# EAGLE design estop_latch_board (EAGLE 5.06)
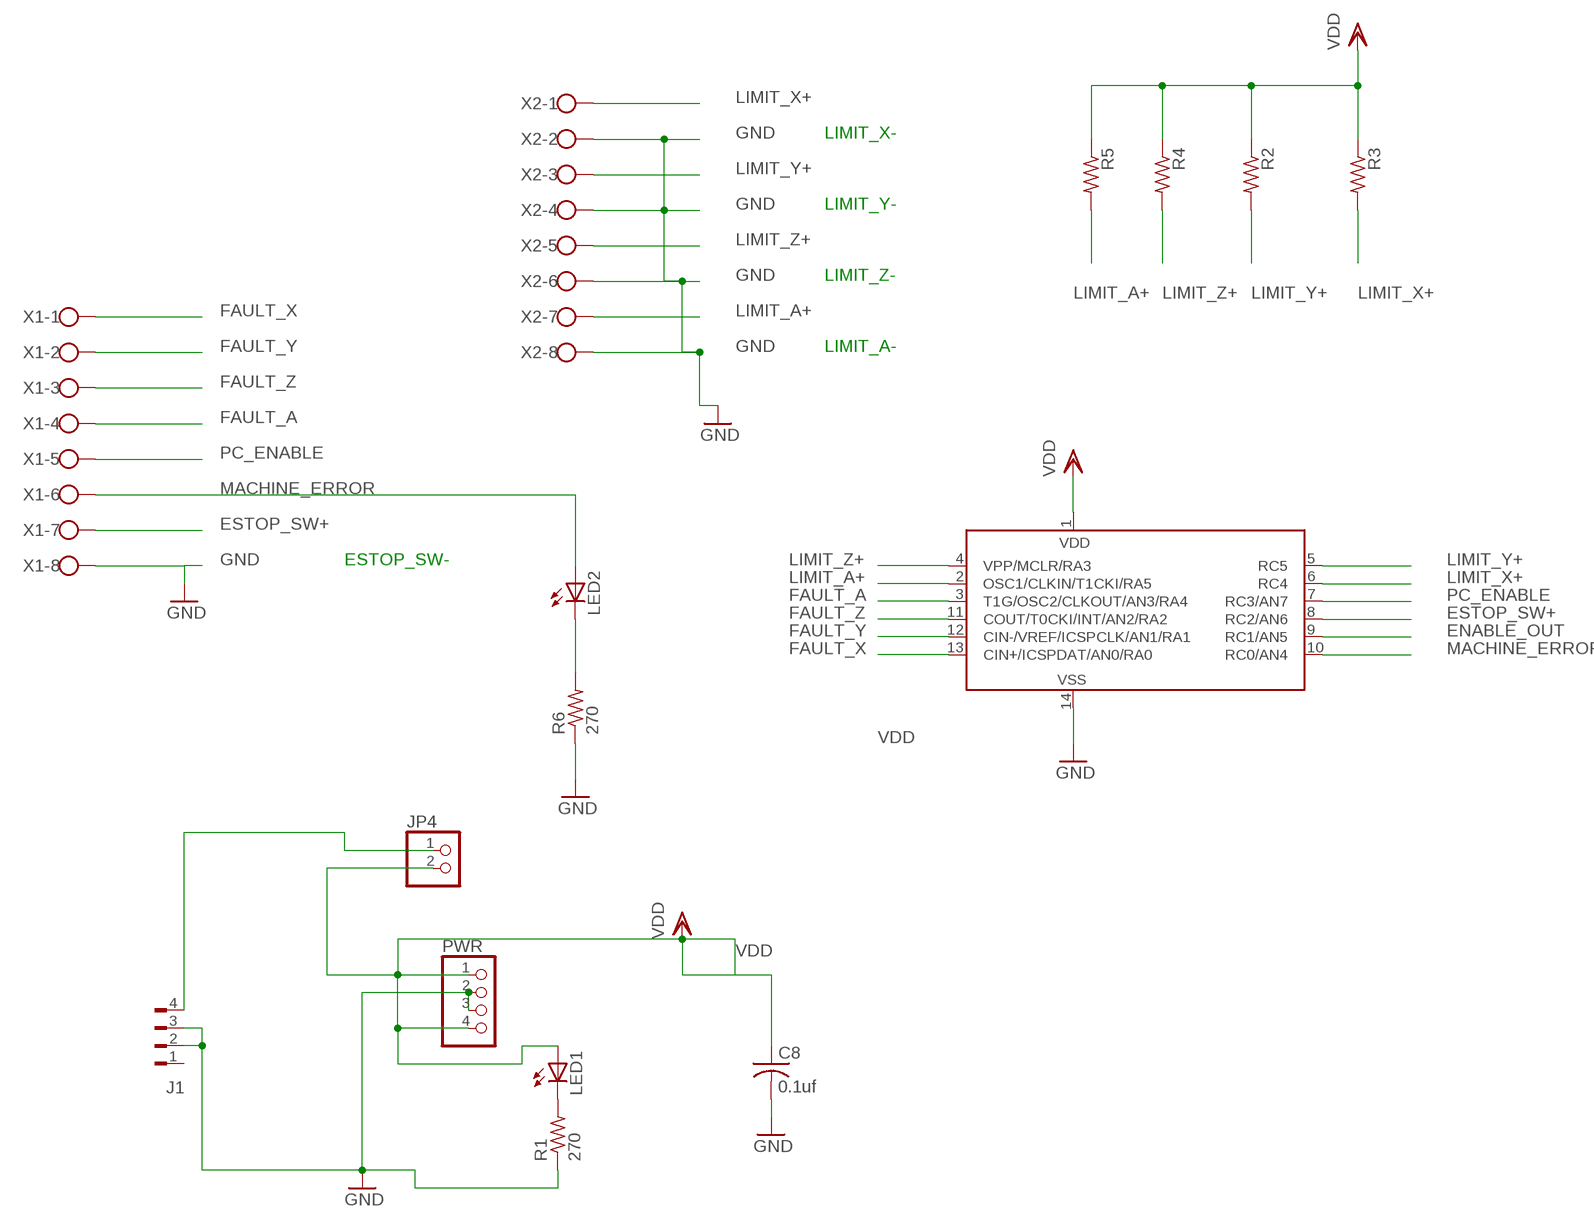
[diagram p0: schematic, sheet 1]

## Parts
C8  0.1uf  C-US025-030X050  [C025-030X050]
IC1  PIC16F676P  [DIL14]
J1  FLOP-4W827001  [827001]
JP4  PINHD-1X2_2.54  [1X02]
LED1  LED3MM  [LED3MM]
LED2  LED3MM  [LED3MM]
PWR  PINHD-1X4  [1X04]
R1  270  R-US_0204/5  [0204/5]
R2  R-US_0204/5  [0204/5]
R3  R-US_0204/5  [0204/5]
R4  R-US_0204/5  [0204/5]
R5  R-US_0204/5  [0204/5]
R6  270  R-US_0204/5  [0204/5]
X1  AK550/8  [AK550/8]
X2  AK550/8  [AK550/8]

## Nets
ENABLE_OUT: IC1.9(RC1/AN5)
ESTOP_SW+: IC1.8(RC2/AN6) X1.7
FAULT_A: IC1.3(T1G/OSC2/CLKOUT/AN3/RA4) X1.4
FAULT_X: IC1.13(CIN+/ICSPDAT/AN0/RA0) X1.1
FAULT_Y: IC1.12(CIN-/VREF/ICSPCLK/AN1/RA1) X1.2
FAULT_Z: IC1.11(COUT/T0CKI/INT/AN2/RA2) X1.3
GND: C8.2 IC1.14(VSS) J1.2 J1.3 PWR.2 PWR.3 R1.1 R6.1 X1.8 X2.2 X2.4 X2.6 X2.8
LIMIT_A+: IC1.2(OSC1/CLKIN/T1CKI/RA5) R5.2 X2.7
LIMIT_X+: IC1.6(RC4) R3.2 X2.1
LIMIT_Y+: IC1.5(RC5) R2.2 X2.3
LIMIT_Z+: IC1.4(VPP/MCLR/RA3) R4.2 X2.5
MACHINE_ERROR: IC1.10(RC0/AN4) LED2.A X1.6
N$1: LED2.K(C) R6.2
N$2: J1.4 JP4.1
N$50: LED1.K(C) R1.2
PC_ENABLE: IC1.7(RC3/AN7) X1.5
VDD: C8.1 IC1.1(VDD) JP4.2 LED1.A PWR.1 PWR.4 R2.1 R3.1 R4.1 R5.1
Unconnected: J1.1

## Notes on the sheet
- LIMIT_X-
- LIMIT_Y-
- LIMIT_Z-
- LIMIT_A-
- ESTOP_SW-

## Library data of the parts
C8 = rcl:C-US: CAPACITOR, American symbol
IC1 = microchip:PIC16F676: 14-Pin, Flash-Based 8-Bit CMOS Microcontroller High Performance RISC CPU: * Only 35 instructions to learn - All single-cycle instructions except branches * Operating speed: - DC - 20 MHz oscillator/clock input - DC - 200 ns instruction cycle * Internal and external oscillator options - Precision Internal 4 MHz oscillator factory calibrated to ±1% - External Oscillator support for crystals and resonators - 5?s wake-up from SLEEP, 3.0V, typical * Power saving SLEEP mode * Wide operating voltage range - 2.0V to 5.5V * Industrial and Extended temperature range * Low power Power-on Reset (POR) * Power-up Timer (PWRT) and Oscillator Start-up Timer (OST) * Brown-out Detect (BOD) * Watchdog Timer (WDT) with independent oscillator for reliable operation * Multiplexed MCLR/Input-pin * Interrupt-on-pin change * Individual programmable weak pull-ups * Programmable code protection * High Endurance FLASH/EEPROM Cell - 100,000 write FLASH endurance - 1,000,000 write EEPROM endurance - FLASH/Data EEPROM Retention: > 40 years * Standby Current: - 1 nA @ 2.0V, typical * Operating Current: - 8.5?A @ 32 kHz, 2.0V, typical - 100?A @ 1 MHz, 2.0V, typical * Watchdog Timer Current - 300 nA @ 2.0V, typical * Timer1 oscillator current: - 4?A @ 32 kHz, 2.0V, typical * 12 I/O pins with individual direction control * High current sink/source for direct LED drive * Analog-to-Digital Converter module (PIC16F676): - 10-bit resolution - Programmable 8-channel input - Voltage reference input * In-Circuit Serial ProgrammingTM (ICSPTM) via two pins Source: http://ww1.microchip.com/downloads/en/DeviceDoc/40039E.pdf
J1 = con-amp:FLOP-4W: MATE N-LOCK Floppy / HDD conector Distributor: Bürklin 71F972
JP4 = pinhead-1:PINHD-1X2: PIN HEADER
LED1 LED2 = led:LED: LED OSRAM: - CHIPLED LG R971, LG N971, LY N971, LG Q971, LY Q971, LO R971, LY R971 LH N974, LH R974 LS Q976, LO Q976, LY Q976 LO Q996 - Hyper CHIPLED LW Q18S LB Q993, LB Q99A, LB R99A - SideLED LS A670, LO A670, LY A670, LG A670, LP A670 LB A673, LV A673, LT A673, LW A673 LH A674 LY A675 LS A676, LA A676, LO A676, LY A676, LW A676 LS A679, LY A679, LG A679 - Hyper Micro SIDELED® LS Y876, LA Y876, LO Y876, LY Y876 LT Y87S - SmartLED LW L88C, LW L88S LB L89C, LB L89S, LG L890 LS L89K, LO L89K, LY L89K LS L896, LA L896, LO L896, LY L896 - TOPLED LS T670, LO T670, LY T670, LG T670, LP T670 LSG T670, LSP T670, LSY T670, LOP T670, LYG T670 LG T671, LOG T671, LSG T671 LB T673, LV T673, LT T673, LW T673 LH T674 LS T676, LA T676, LO T676, LY T676, LB T676, LH T676, LSB T676, LW T676 LB T67C, LV T67C, LT T67C, LS T67K, LO T67K, LY T67K, LW E67C LS E67B, LA E67B, LO E67B, LY E67B, LB E67C, LV E67C, LT E67C LW T67C LS T679, LY T679, LG T679 LS T770, LO T770, LY T770, LG T770, LP T770 LB T773, LV T773, LT T773, LW T773 LH T774 LS E675, LA E675, LY E675, LS T675 LS T776, LA T776, LO T776, LY T776, LB T776 LHGB T686 LT T68C, LB T68C - Hyper Mini TOPLED® LB M676 - Mini TOPLED Santana® LG M470 LS M47K, LO M47K, LY M47K Source: http://www.osram.convergy.de LUXEON: - LUMILED® LXK2-PW12-R00, LXK2-PW12-S00, LXK2-PW14-U00, LXK2-PW14-V00 LXK2-PM12-R00, LXK2-PM12-S00, LXK2-PM14-U00 LXK2-PE12-Q00, LXK2-PE12-R00, LXK2-PE12-S00, LXK2-PE14-T00, LXK2-PE14-U00 LXK2-PB12-K00, LXK2-PB12-L00, LXK2-PB12-M00, LXK2-PB14-N00, LXK2-PB14-P00, LXK2-PB14-Q00 LXK2-PR12-L00, LXK2-PR12-M00, LXK2-PR14-Q00, LXK2-PR14-R00 LXK2-PD12-Q00, LXK2-PD12-R00, LXK2-PD12-S00 LXK2-PH12-R00, LXK2-PH12-S00 LXK2-PL12-P00, LXK2-PL12-Q00, LXK2-PL12-R00 Source: www.luxeon.com KINGBRIGHT: KA-3528ASYC Source: www.kingbright.com
PWR = pinhead:PINHD-1X4: PIN HEADER
R1-R6 = rcl:R-US_: RESISTOR, American symbol
X1 X2 = con-ptr500+:AK550/8: CONNECTOR

## Board
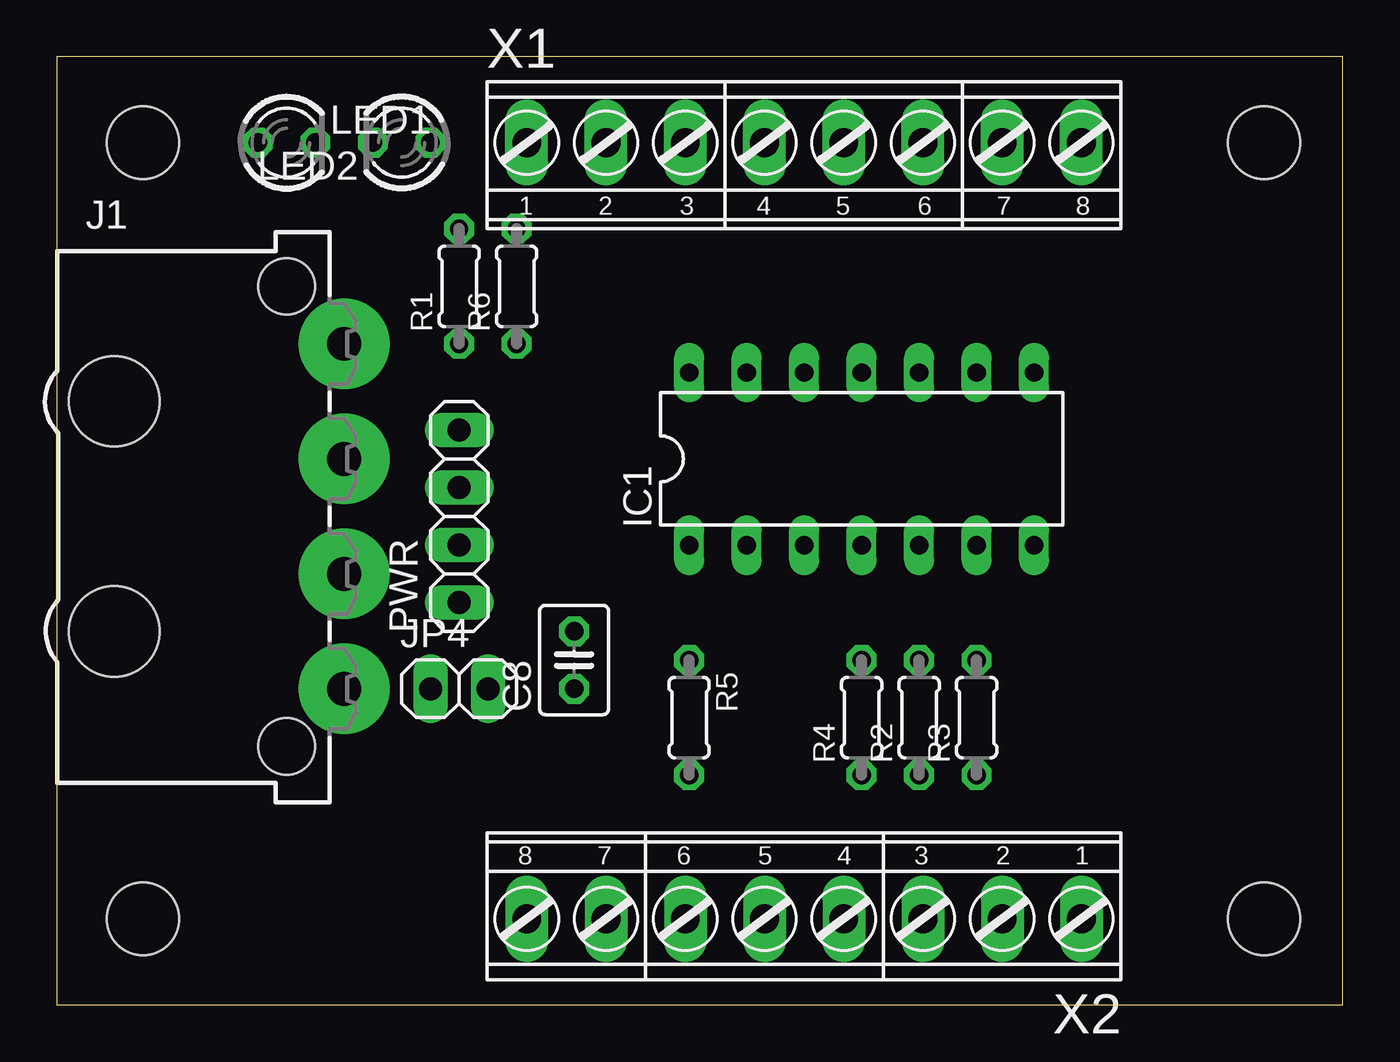
[diagram p1: board, top side]
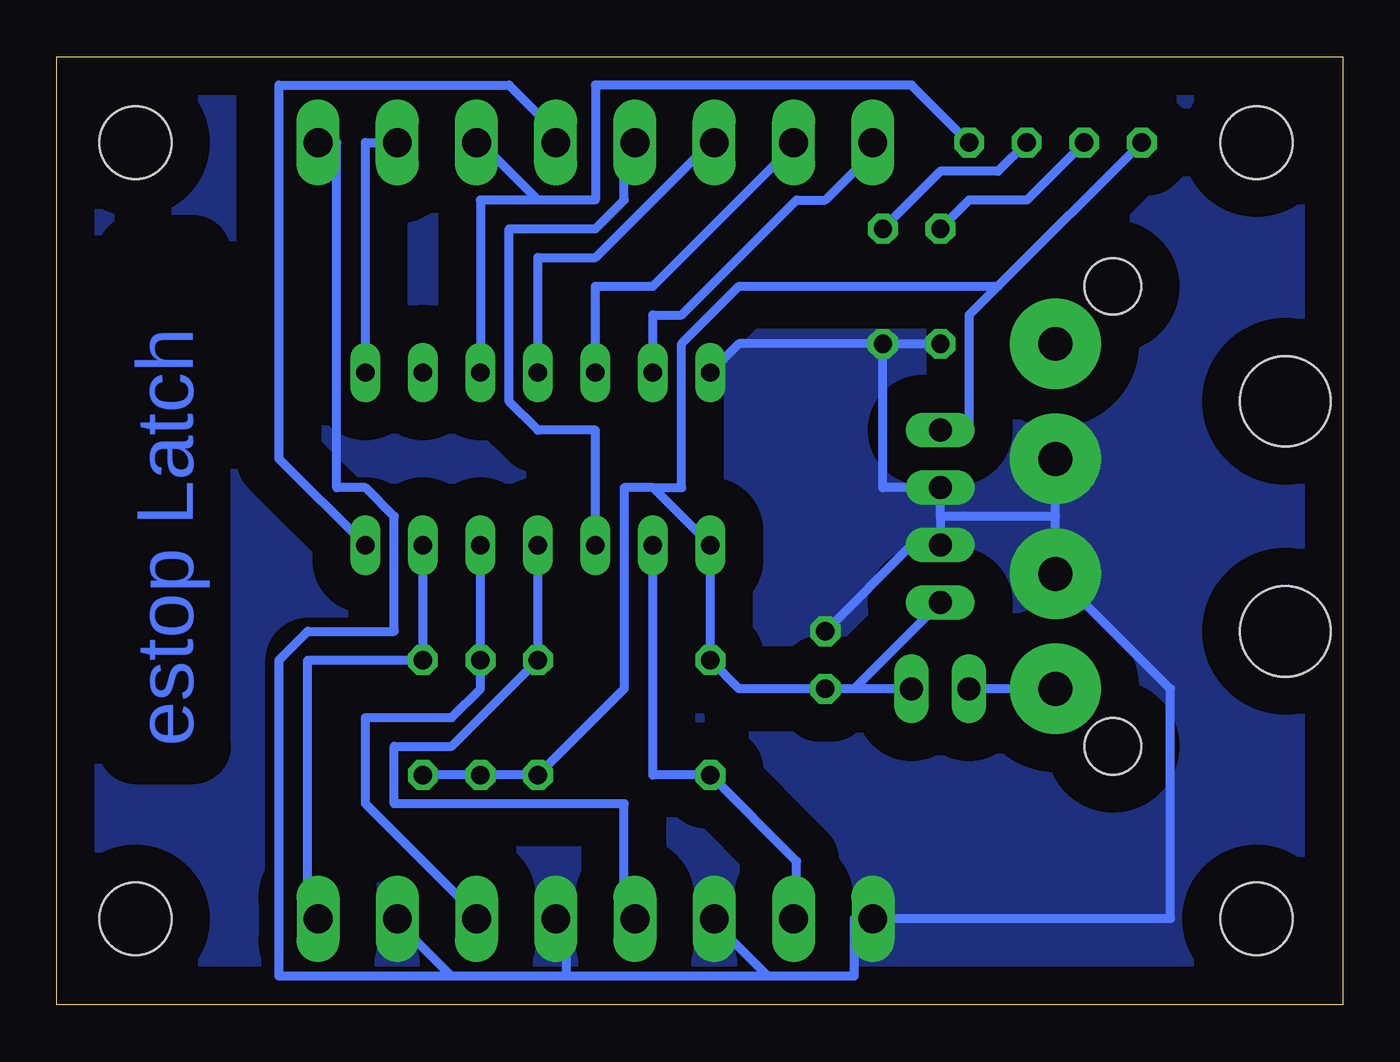
[diagram p2: board, bottom side, seen from below]

Size 56.82 x 41.9 mm. Coordinates in mm from the lower left corner, seen from the top.
Outline: 0,0 56.82,0 56.82,41.9 0,41.9 0,0
Copper layers (1*16): Top 0.035mm / dielectric 1.5mm / Bottom 0.035mm
Design rules "dave_big": minimum track width 16mil, minimum drill 24mil, track to track 14mil, track to pad 14mil, pad to pad 14mil, via to via 14mil, smd to smd 8mil, copper to edge 40mil, drill to drill 8mil, minimum pad ring 10mil, minimum via ring 8mil, stop-mask expansion 4mil, vias tented up to drill 0mil, thermal gap 10mil
Holes 3.2 mm at 3.81,3.81 53.34,3.81 3.81,38.1 53.34,38.1

### Footprints (pad centres in the part's own frame; a part is rotated, then mirrored left to right if it is on the bottom)
C025-030X050 = drill 0.813 octagon: 1 -1.27,0; 2 1.27,0
DIL14 = drill 0.813 long: 1 -7.62,-3.81; 2 -5.08,-3.81; 3 -2.54,-3.81; 4 0,-3.81; 5 2.54,-3.81; 6 5.08,-3.81; 7 7.62,-3.81; 8 7.62,3.81; 9 5.08,3.81; 10 2.54,3.81; 11 0,3.81; 12 -2.54,3.81; 13 -5.08,3.81; 14 -7.62,3.81
827001 = drill 1.5 pad 4 round: 1 -7.62,0; 2 -2.54,0; 3 2.54,0; 4 7.62,0 | hole 4: 5.08,-10.16; -5.08,-10.16 | hole 2.5: 10.16,-2.54; -10.16,-2.54
1X02 = drill 1.016 long: 1 -1.27,0; 2 1.27,0
LED3MM = drill 0.813 octagon: A -1.27,0; K 1.27,0
1X04 = drill 1.016 long: 1 -3.81,0; 2 -1.27,0; 3 1.27,0; 4 3.81,0
0204/5 = drill 0.813 octagon: 1 -2.54,0; 2 2.54,0
AK550/8 = drill 1.27 long: 1 -12.25,0; 2 -8.75,0; 3 -5.25,0; 4 -1.75,0; 5 1.75,0; 6 5.25,0; 7 8.75,0; 8 12.25,0

### Placement (x,y rotation side)
C8  22.86,15.24 90 top
IC1  35.56,24.13 0 top
J1  12.7,21.59 270 top
JP4  17.78,13.97 0 top
LED1  10.16,38.1 0 top
LED2  15.24,38.1 180 top
PWR  17.78,21.59 90 top
R1  17.78,31.75 90 top
R2  38.1,12.7 90 top
R3  40.64,12.7 90 top
R4  35.56,12.7 90 top
R5  27.94,12.7 270 top
R6  20.32,31.75 90 top
X1  33.02,38.1 0 top
X2  33.02,3.81 180 top

### Tracks (layer width: path | path; a pad name or v marks a point on that pad's centre or on a via)
ESTOP_SW+
  Bottom 0.406: IC1.8 43.18,38.1 X1.7
FAULT_A
  Bottom 0.406: IC1.3 33.02,25.4 35.56,25.4 36.83,26.67 36.83,34.29 33.02,34.29 31.75,35.56 31.75,38.1 X1.4
FAULT_X
  Bottom 0.406: IC1.13 30.48,30.48 29.21,30.48 24.13,35.56 22.86,35.56 20.32,38.1 X1.1
FAULT_Y
  Bottom 0.406: IC1.12 33.02,31.75 30.48,31.75 24.13,38.1 X1.2
FAULT_Z
  Bottom 0.406: IC1.11 35.56,33.02 33.02,33.02 27.94,38.1 X1.3
GND
  Bottom 0.406: 12.7,21.59 J1.2 | 12.7,21.59 J1.3 7.62,13.97 7.62,3.81 X2.8 21.59,3.81 21.59,1.27 25.4,1.27 | R6.1 R1.1 | IC1.14 26.67,29.21 R6.1 | C8.2 19.05,20.32 PWR.2 17.78,21.59 | 17.78,21.59 PWR.3 20.32,22.86 R6.1 | 12.7,21.59 17.78,21.59 | 25.4,1.27 27.94,3.81 X2.6 | 34.29,1.27 34.29,3.81 X2.4 | 25.4,1.27 34.29,1.27 | 39.37,1.27 41.91,3.81 X2.2 | 34.29,1.27 39.37,1.27 | 39.37,1.27 46.99,1.27 46.99,15.24 45.72,16.51 41.91,16.51 41.91,21.59 43.18,22.86 44.45,22.86 44.45,38.1 X1.8
  pour Bottom (isolate 1.676, no thermals): 0,41.91 57.15,41.91 57.15,0 0,0
LIMIT_A+
  Bottom 0.406: X2.7 24.13,3.81 24.13,6.35 R5.2 30.48,10.16 IC1.2
LIMIT_X+
  Bottom 0.406: IC1.6 R3.2 45.72,15.24 45.72,3.81 X2.1
LIMIT_Y+
  Bottom 0.406: IC1.5 R2.2 38.1,13.97 39.37,12.7 43.18,12.7 43.18,8.89 38.1,3.81 X2.3
LIMIT_Z+
  Bottom 0.406: IC1.4 R4.2 39.37,11.43 41.91,11.43 41.91,8.89 31.75,8.89 31.75,3.81 X2.5
MACHINE_ERROR
  Bottom 0.406: LED2.A 19.05,40.64 33.02,40.64 33.02,35.56 35.56,35.56 | 35.56,35.56 38.1,38.1 X1.6 | IC1.10 38.1,35.56 35.56,35.56
N$1
  Bottom 0.406: R6.2 17.78,36.83 15.24,36.83 LED2.K
N$2
  Bottom 0.406: J1.4 JP4.1
N$50
  Bottom 0.406: R1.2 16.51,35.56 13.97,35.56 LED1.K
PC_ENABLE
  Bottom 0.406: IC1.7 46.99,24.13 46.99,40.64 36.83,40.64 34.29,38.1 X1.5
VDD
  Bottom 0.406: 15.24,31.75 16.51,30.48 16.51,25.4 PWR.4 | 15.24,31.75 LED1.A | R3.1 R2.1 R4.1 31.75,13.97 31.75,22.86 30.48,22.86 | JP4.2 21.59,13.97 | 21.59,13.97 C8.1 26.67,13.97 R5.1 IC1.1 30.48,22.86 | 21.59,13.97 PWR.1 | 15.24,31.75 26.67,31.75 29.21,29.21 29.21,22.86 30.48,22.86

### Text on the board
Bottom: estop Latch